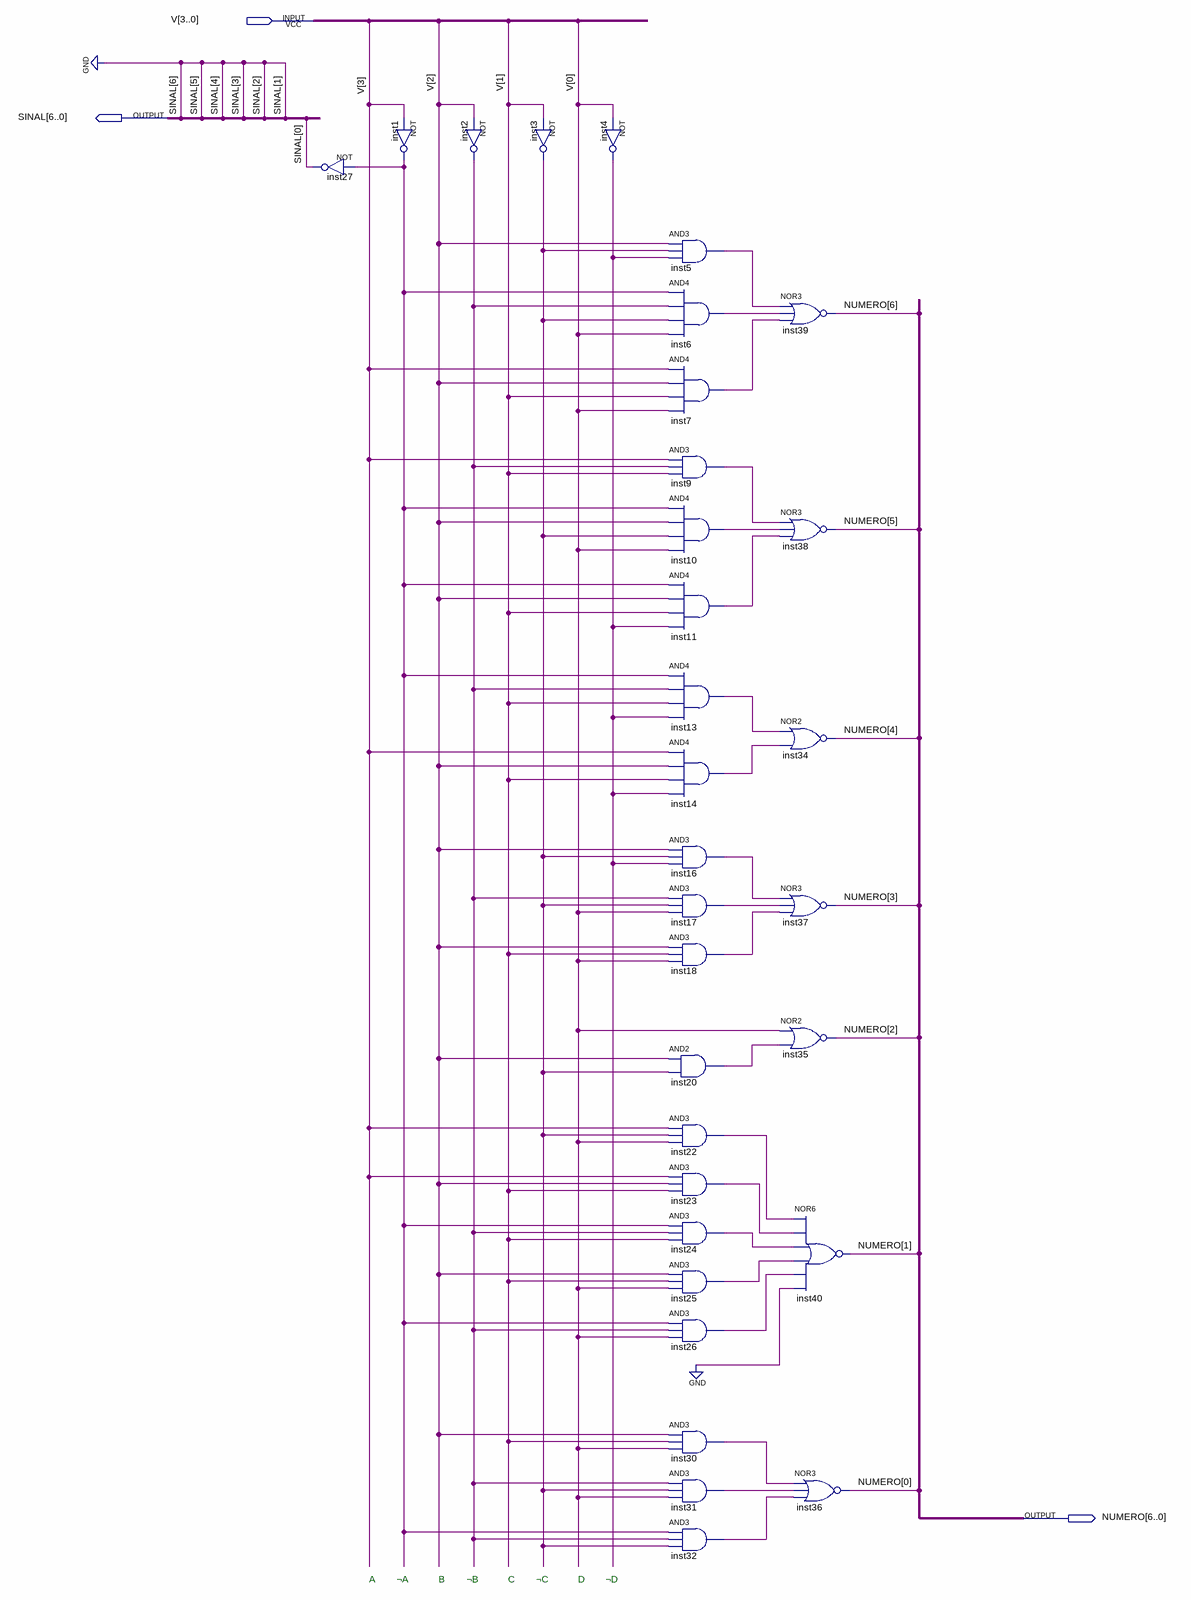
[diagram p0: schematic sheet]
// Quartus schematic Decodificador.bdf as structural Verilog: 32 symbols, 3 pins
module Decodificador (
  input  [3:0] V,
  output [6:0] SINAL,
  output [6:0] NUMERO
);

  wire inst1_out, inst2_out, inst3_out, inst4_out, inst5_out, inst6_out, inst7_out, inst9_out, inst10_out,
       inst11_out, inst13_out, inst14_out, inst16_out, inst17_out, inst18_out, inst20_out, inst22_out,
       inst23_out, inst24_out, inst25_out, inst26_out, inst30_out, inst31_out, inst32_out;

  not inst27 (SINAL[0], inst1_out);
  not inst1 (inst1_out, V[3]);
  not inst2 (inst2_out, V[2]);
  not inst3 (inst3_out, V[1]);
  not inst4 (inst4_out, V[0]);
  and inst5 (inst5_out, V[2], inst3_out, inst4_out);
  and inst6 (inst6_out, inst1_out, inst2_out, inst3_out, V[0]);
  and inst7 (inst7_out, V[3], V[2], V[1], V[0]);
  and inst9 (inst9_out, V[3], inst2_out, V[1]);
  and inst10 (inst10_out, inst1_out, V[2], inst3_out, V[0]);
  and inst11 (inst11_out, inst1_out, V[2], V[1], inst4_out);
  and inst13 (inst13_out, inst1_out, inst2_out, V[1], inst4_out);
  and inst14 (inst14_out, V[3], V[2], V[1], inst4_out);
  and inst16 (inst16_out, V[2], inst3_out, inst4_out);
  and inst17 (inst17_out, inst2_out, inst3_out, V[0]);
  and inst18 (inst18_out, V[2], V[1], V[0]);
  and inst20 (inst20_out, V[2], inst3_out);
  and inst22 (inst22_out, V[3], inst3_out, V[0]);
  and inst23 (inst23_out, V[3], V[2], V[1]);
  and inst24 (inst24_out, inst1_out, inst2_out, V[1]);
  and inst25 (inst25_out, V[2], V[1], V[0]);
  and inst26 (inst26_out, inst1_out, inst2_out, V[0]);
  and inst30 (inst30_out, V[2], V[1], V[0]);
  and inst31 (inst31_out, inst2_out, inst3_out, V[0]);
  and inst32 (inst32_out, inst1_out, inst2_out, inst3_out);
  nor inst39 (NUMERO[6], inst5_out, inst6_out, inst7_out);
  nor inst38 (NUMERO[5], inst9_out, inst10_out, inst11_out);
  nor inst34 (NUMERO[4], inst13_out, inst14_out);
  nor inst37 (NUMERO[3], inst16_out, inst17_out, inst18_out);
  nor inst35 (NUMERO[2], V[0], inst20_out);
  nor inst40 (NUMERO[1], inst22_out, inst23_out, inst24_out, inst25_out, inst26_out, 1'b0);
  nor inst36 (NUMERO[0], inst30_out, inst31_out, inst32_out);

  assign SINAL[6:1] = {6{1'b0}};

  // Notes on the sheet:
  //   A
  //   ¬A
  //   B
  //   ¬B
  //   C
  //   ¬C
  //   D
  //   ¬D
endmodule
